# Altium schematic sheet Sheet2.SchDoc
size A4
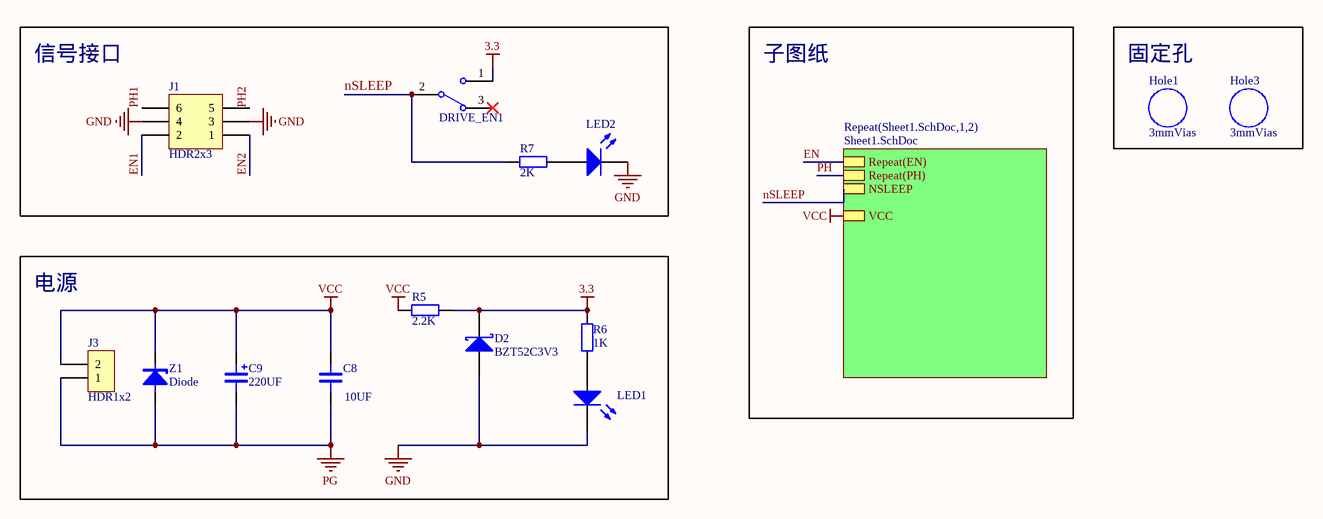
[diagram p0: Sheet2.SchDoc]

## Parts
C8  10UF  [0603]
C9  220UF  [DIP-EC3.5X8X11.5]
D2  BZT52C3V3  [SOD-123]
DRIVE_EN1  SW-SPDT  [ss12d10]  (value not drawn)
Hole1  3mmVias  [3mm]
Hole3  3mmVias  [3mm]
J1  HDR2x3  [pin_2*3]
J3  HDR1x2  [TX30_接口]
LED1  LED0  [0603-led]  (value not drawn)
LED2  LED0  [0603-led]  (value not drawn)
R5  2.2K  [0603]
R6  1K  [0603]
R7  2K  [0603]
Z1  Diode  [SMA]

## Blocks framed on the sheet
信号接口: DRIVE_EN1 J1 LED2 R7
固定孔: Hole1 Hole3
电源: C8 C9 D2 J3 LED1 R5 R6 Z1

## Sub-sheets
Repeat(Sheet1.SchDoc,1,2) = Sheet1.SchDoc: Repeat(EN), Repeat(PH), NSLEEP, VCC

## Nets
3.3: D2.1(K) DRIVE_EN1.1 R5.1 R6.1
GND: D2.3(A) J1.3 J1.4 LED1.2(K) LED2.2(K)
PG: C8.1 C9.2 J3.1 Z1.1(A)
VCC: C8.2 C9.1 J3.2 R5.2 Z1.2(C) ; sheet Repeat(Sheet1.SchDoc,1,2)/VCC
EN: sheet Repeat(Sheet1.SchDoc,1,2)/Repeat(EN)
EN1: J1.2
EN2: J1.1
nSLEEP: DRIVE_EN1.2 R7.2 ; sheet Repeat(Sheet1.SchDoc,1,2)/NSLEEP
PH: sheet Repeat(Sheet1.SchDoc,1,2)/Repeat(PH)
PH1: J1.6
PH2: J1.5
NetLED1_1: LED1.1(A) R6.2
NetLED2_1: LED2.1(A) R7.1

Not connected (* = marked no-connect by the designer): DRIVE_EN1 3*

## Notes on the sheet
- 子图纸

## Library data of the parts
C8 = CAP: Capacitor
C9 = CAP-TANTALUM: Tantalum Capacitor
D2 = Diode 18TQ045: Schottky Rectifier; Note: Terminal 2 is the TAB and is electrically connected to the cathode; Published: 8-Jun-2000; LatestRevisionDate: 17-Jul-2002; LatestRevisionNote: Re-released for DXP Platform.; DatasheetVersion: Dec-1997; PackageVersion: Feb-1998; PackageReference: TO-220AC; Publisher: Altium Limited; PackageDescription: TO, Thru-Hole, Vertical, Heatsink Mounted; 3 In-Line Leads (1 Absent); Pitch 2.54 mm; ComponentLink1Description: Manufacturer Link; ComponentLink1URL: http://www.irf.com/; ComponentLink2Description: Datasheet; ComponentLink2URL: http://www.irf.com/product-info/datasheets/data/18tq.pdf
DRIVE_EN1 = SW-SPDT: SPDT Subminiature Toggle Switch, Right Angle Mounting, Vertical Actuation; Published: 24-Mar-1999; LatestRevisionDate: 17-Dec-2003; LatestRevisionNote: Schematic revised, PCB Footprint replaced.; DatasheetVersion: 05-Dec-2000; PackageReference: TL36WW15050; Publisher: Altium Limited; PackageDescription: Switch; 4 Leads; ComponentLink1Description: Manufacturer Link; ComponentLink1URL: http://www.apem.com
J1 = HDR2x3: Connector
J3 = HDR1x2: Connector
LED1 LED2 = LED0: Typical INFRARED GaAs LED; Published: 8-Jun-2000; LatestRevisionDate: 08-Jul-2005; LatestRevisionNote: Mech Layer 1 removed.; PackageReference: LED-0; Publisher: Altium Limited; PackageDescription: LED; 2 Leads
R5-R7 = RES: Resistor
Z1 = Diode: Zener Diode